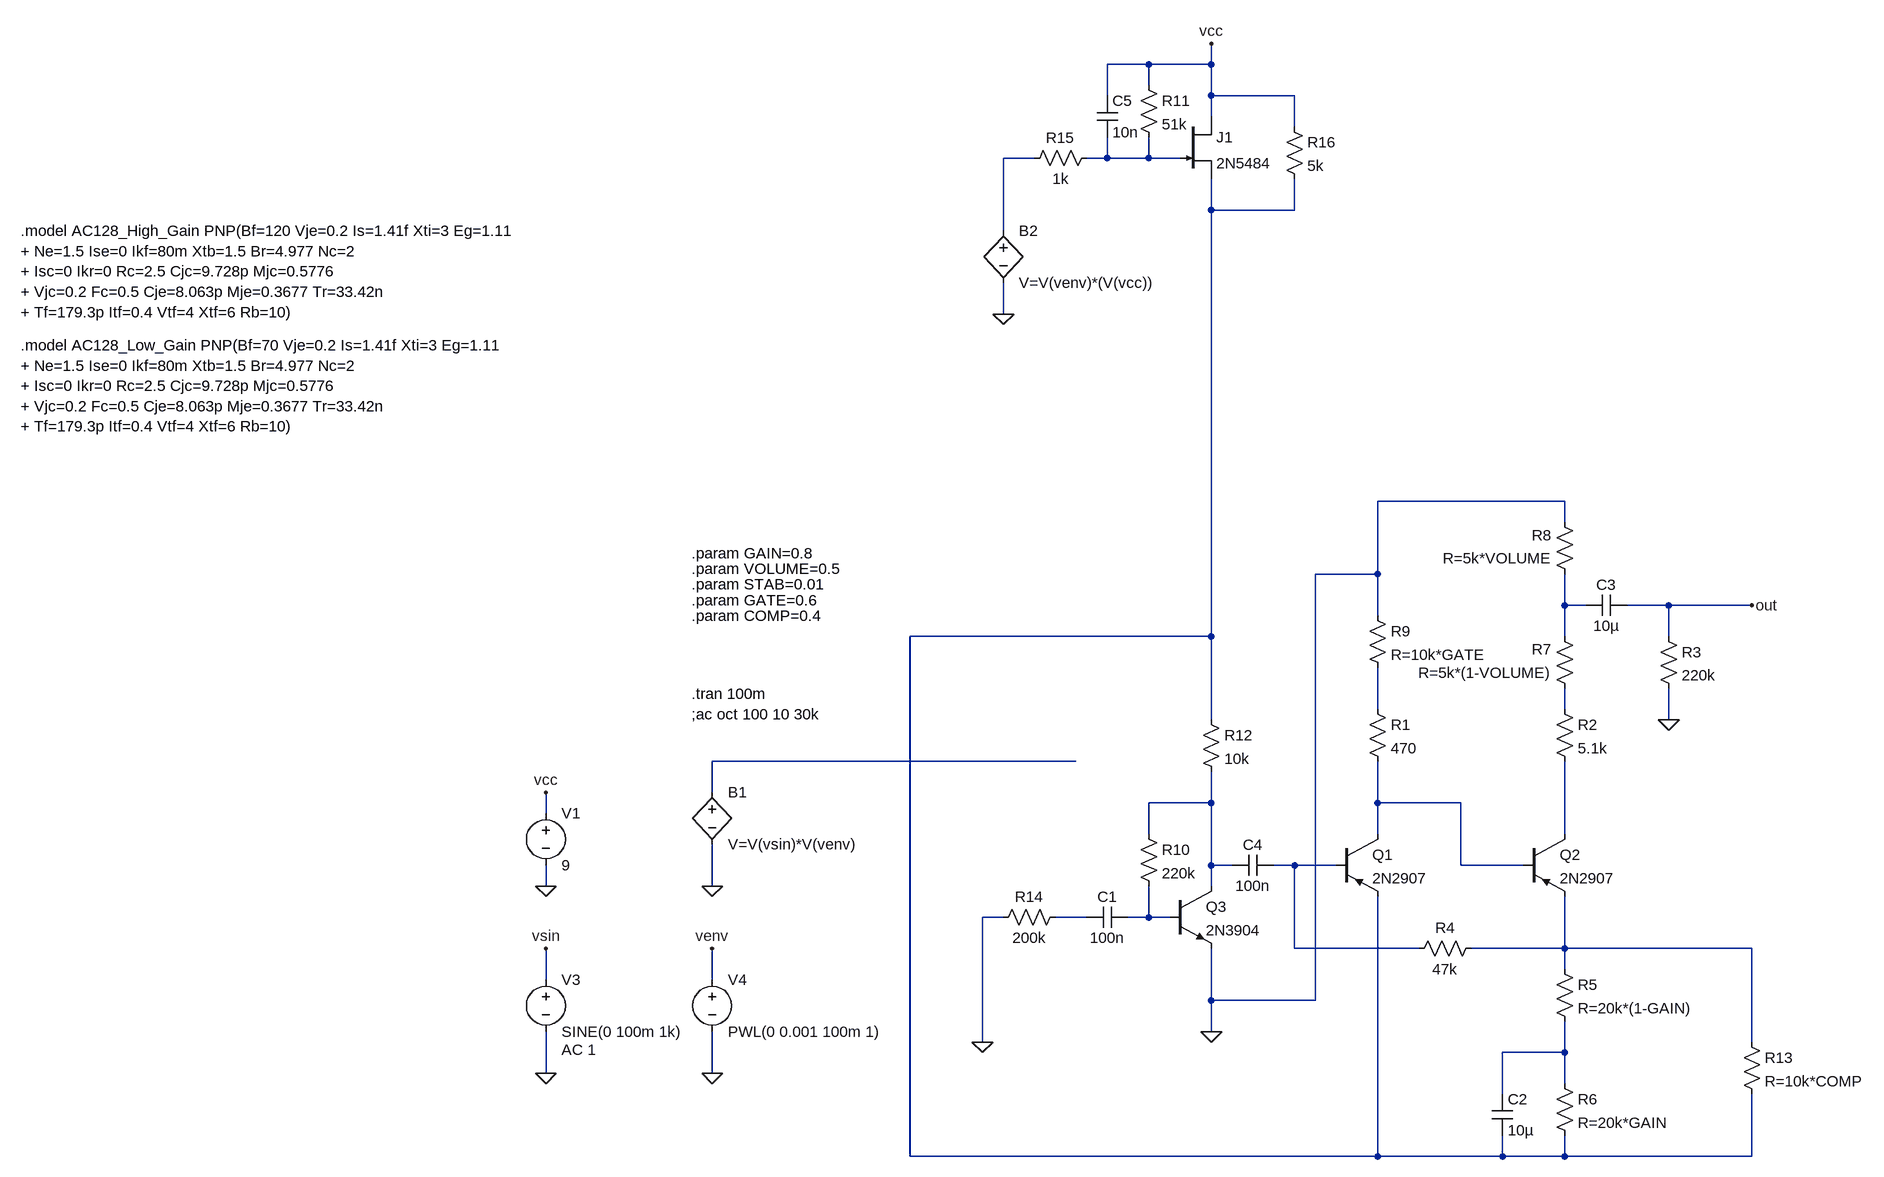
[diagram p0: schematic fuzz_factory_05.asc]
fuzz_factory_05.asc, the LTspice schematic file:
Version 4
SHEET 1 1968 1668
WIRE -64 -1040 -128 -1040
WIRE 32 -1040 32 -1072
WIRE 32 -1040 -64 -1040
WIRE -64 -1008 -64 -1040
WIRE -128 -992 -128 -1040
WIRE 32 -992 32 -1040
WIRE 160 -992 32 -992
WIRE 32 -960 32 -992
WIRE 160 -944 160 -992
WIRE -240 -896 -288 -896
WIRE -128 -896 -128 -928
WIRE -128 -896 -160 -896
WIRE -64 -896 -64 -928
WIRE -64 -896 -128 -896
WIRE -16 -896 -64 -896
WIRE 32 -816 32 -864
WIRE 160 -816 160 -864
WIRE 160 -816 32 -816
WIRE -288 -784 -288 -896
WIRE -288 -656 -288 -704
WIRE 576 -368 288 -368
WIRE 576 -336 576 -368
WIRE 288 -256 288 -368
WIRE 288 -256 192 -256
WIRE 576 -208 576 -256
WIRE 608 -208 576 -208
WIRE 736 -208 672 -208
WIRE 864 -208 736 -208
WIRE 288 -192 288 -256
WIRE 32 -160 32 -816
WIRE 32 -160 -432 -160
WIRE 576 -160 576 -208
WIRE 736 -160 736 -208
WIRE 288 -48 288 -112
WIRE 576 -48 576 -80
WIRE 32 -32 32 -160
WIRE 736 -32 736 -80
WIRE -176 32 -736 32
WIRE -736 80 -736 32
WIRE 32 96 32 48
WIRE 32 96 -64 96
WIRE 288 96 288 32
WIRE 416 96 288 96
WIRE -992 112 -992 80
WIRE -64 144 -64 96
WIRE 288 144 288 96
WIRE 576 144 576 32
WIRE 32 192 32 96
WIRE 64 192 32 192
WIRE 160 192 128 192
WIRE 224 192 160 192
WIRE 416 192 416 96
WIRE 512 192 416 192
WIRE -992 224 -992 192
WIRE -736 224 -736 160
WIRE 32 224 32 192
WIRE -288 272 -320 272
WIRE -160 272 -208 272
WIRE -64 272 -64 224
WIRE -64 272 -96 272
WIRE -32 272 -64 272
WIRE 160 320 160 192
WIRE 352 320 160 320
WIRE 576 320 576 240
WIRE 576 320 432 320
WIRE 864 320 576 320
WIRE 576 352 576 320
WIRE -992 368 -992 320
WIRE -736 368 -736 320
WIRE 32 400 32 320
WIRE 192 400 192 -256
WIRE 192 400 32 400
WIRE 32 448 32 400
WIRE -320 464 -320 272
WIRE 864 464 864 320
WIRE 576 480 576 432
WIRE 576 480 480 480
WIRE -992 512 -992 448
WIRE -736 512 -736 448
WIRE 576 528 576 480
WIRE 480 544 480 480
WIRE -432 640 -432 -160
WIRE 288 640 288 240
WIRE 288 640 -432 640
WIRE 480 640 480 608
WIRE 480 640 288 640
WIRE 576 640 576 608
WIRE 576 640 480 640
WIRE 864 640 864 544
WIRE 864 640 576 640
FLAG -992 80 vcc
FLAG -992 224 0
FLAG 864 -208 out
FLAG -736 224 0
FLAG -992 512 0
FLAG -736 512 0
FLAG -992 320 vsin
FLAG -736 320 venv
FLAG 736 -32 0
FLAG -320 464 0
FLAG 32 448 0
FLAG -288 -656 0
FLAG 32 -1072 vcc
SYMBOL voltage -992 96 R0
WINDOW 123 0 0 Left 2
WINDOW 39 0 0 Left 2
SYMATTR InstName V1
SYMATTR Value 9
SYMBOL voltage -992 352 R0
WINDOW 123 24 124 Left 2
WINDOW 39 0 0 Left 2
SYMATTR Value2 AC 1
SYMATTR InstName V3
SYMATTR Value SINE(0 100m 1k)
SYMBOL voltage -736 352 R0
WINDOW 123 0 0 Left 2
WINDOW 39 0 0 Left 2
SYMATTR InstName V4
SYMATTR Value PWL(0 0.001 100m 1)
SYMBOL bv -736 64 R0
SYMATTR InstName B1
SYMATTR Value V=V(vsin)*V(venv)
SYMBOL pnp 224 144 R0
SYMATTR InstName Q1
SYMATTR Value 2N2907
SYMBOL pnp 512 144 R0
SYMATTR InstName Q2
SYMATTR Value 2N2907
SYMBOL cap -96 256 R90
WINDOW 0 0 32 VBottom 2
WINDOW 3 32 32 VTop 2
SYMATTR InstName C1
SYMATTR Value 100n
SYMBOL res 272 -64 R0
SYMATTR InstName R1
SYMATTR Value 470
SYMBOL res 560 -64 R0
SYMATTR InstName R2
SYMATTR Value 5.1k
SYMBOL res 448 304 R90
WINDOW 0 0 56 VBottom 2
WINDOW 3 32 56 VTop 2
SYMATTR InstName R4
SYMATTR Value 47k
SYMBOL res 560 336 R0
SYMATTR InstName R5
SYMATTR Value R=20k*(1-GAIN)
SYMBOL res 560 512 R0
SYMATTR InstName R6
SYMATTR Value R=20k*GAIN
SYMBOL cap 464 544 R0
SYMATTR InstName C2
SYMATTR Value 10µ
SYMBOL res 592 -64 R180
WINDOW 0 36 76 Left 2
WINDOW 3 36 40 Left 2
SYMATTR InstName R7
SYMATTR Value R=5k*(1-VOLUME)
SYMBOL res 592 -240 R180
WINDOW 0 36 76 Left 2
WINDOW 3 36 40 Left 2
SYMATTR InstName R8
SYMATTR Value R=5k*VOLUME
SYMBOL npn -32 224 R0
SYMATTR InstName Q3
SYMATTR Value 2N3904
SYMBOL res -80 128 R0
SYMATTR InstName R10
SYMATTR Value 220k
SYMBOL cap 128 176 R90
WINDOW 0 0 32 VBottom 2
WINDOW 3 32 32 VTop 2
SYMATTR InstName C4
SYMATTR Value 100n
SYMBOL cap 672 -224 R90
WINDOW 0 0 32 VBottom 2
WINDOW 3 32 32 VTop 2
SYMATTR InstName C3
SYMATTR Value 10µ
SYMBOL res 720 -176 R0
SYMATTR InstName R3
SYMATTR Value 220k
SYMBOL res 272 -208 R0
SYMATTR InstName R9
SYMATTR Value R=10k*GATE
SYMBOL res 16 -48 R0
SYMATTR InstName R12
SYMATTR Value 10k
SYMBOL res 848 448 R0
SYMATTR InstName R13
SYMATTR Value R=10k*COMP
SYMBOL res -192 256 R90
WINDOW 0 0 56 VBottom 2
WINDOW 3 32 56 VTop 2
SYMATTR InstName R14
SYMATTR Value 200k
SYMBOL bv -288 -800 R0
SYMATTR InstName B2
SYMATTR Value V=V(venv)*(V(vcc))
SYMBOL njf -16 -960 R0
SYMATTR InstName J1
SYMATTR Value 2N5484
SYMBOL res -80 -1024 R0
SYMATTR InstName R11
SYMATTR Value 51k
SYMBOL cap -144 -992 R0
SYMATTR InstName C5
SYMATTR Value 10n
SYMBOL res -144 -912 R90
WINDOW 0 0 56 VBottom 2
WINDOW 3 32 56 VTop 2
SYMATTR InstName R15
SYMATTR Value 1k
SYMBOL res 144 -960 R0
SYMATTR InstName R16
SYMATTR Value 5k
TEXT -768 -288 Left 2 !.param GAIN=0.8
TEXT -768 -264 Left 2 !.param VOLUME=0.5
TEXT -768 -240 Left 2 !.param STAB=0.01
TEXT -768 -72 Left 2 !.tran 100m
TEXT -768 -40 Left 2 !;ac oct 100 10 30k
TEXT -1800 -608 Left 2 !.model AC128_Low_Gain PNP(Bf=70 Vje=0.2 Is=1.41f Xti=3 Eg=1.11\n+ Ne=1.5 Ise=0 Ikf=80m Xtb=1.5 Br=4.977 Nc=2\n+ Isc=0 Ikr=0 Rc=2.5 Cjc=9.728p Mjc=0.5776\n+ Vjc=0.2 Fc=0.5 Cje=8.063p Mje=0.3677 Tr=33.42n\n+ Tf=179.3p Itf=0.4 Vtf=4 Xtf=6 Rb=10)
TEXT -1800 -784 Left 2 !.model AC128_High_Gain PNP(Bf=120 Vje=0.2 Is=1.41f Xti=3 Eg=1.11\n+ Ne=1.5 Ise=0 Ikf=80m Xtb=1.5 Br=4.977 Nc=2\n+ Isc=0 Ikr=0 Rc=2.5 Cjc=9.728p Mjc=0.5776\n+ Vjc=0.2 Fc=0.5 Cje=8.063p Mje=0.3677 Tr=33.42n\n+ Tf=179.3p Itf=0.4 Vtf=4 Xtf=6 Rb=10)
TEXT -768 -216 Left 2 !.param GATE=0.6
TEXT -768 -192 Left 2 !.param COMP=0.4

The netlist it stands for:
* fuzz_factory_05.asc
V1 vcc 0 9
V3 vsin 0 SINE(0 100m 1k) AC 1
V4 venv 0 PWL(0 0.001 100m 1)
B1 N007 0 V=V(vsin)*V(venv)
Q1 N009 N011 N003 0 2N2907
Q2 N010 N009 N014 0 2N2907
C1 N013 N012 100n
R1 N005 N009 470
R2 N006 N010 5.1k
R4 N014 N011 47k
R5 N014 N015 R=20k*(1-GAIN)
R6 N015 N003 R=20k*GAIN
C2 N015 N003 10µ
R7 N006 N004 R=5k*(1-VOLUME)
R8 N004 0 R=5k*VOLUME
Q3 N008 N013 0 0 2N3904
R10 N008 N013 220k
C4 N011 N008 100n
C3 out N004 10µ
R3 out 0 220k
R9 0 N005 R=10k*GATE
R12 N003 N008 10k
R13 N014 N003 R=10k*COMP
R14 N012 0 200k
B2 N001 0 V=V(venv)*(V(vcc))
J1 vcc N002 N003 2N5484
R11 vcc N002 51k
C5 vcc N002 10n
R15 N002 N001 1k
R16 vcc N003 5k
.model NPN NPN
.model PNP PNP
.lib standard.bjt
.model NJF NJF
.model PJF PJF
.lib standard.jft
.param GAIN=0.8
.param VOLUME=0.5
.param STAB=0.01
.tran 100m
;ac oct 100 10 30k
.model AC128_Low_Gain PNP(Bf=70 Vje=0.2 Is=1.41f Xti=3 Eg=1.11
+ Ne=1.5 Ise=0 Ikf=80m Xtb=1.5 Br=4.977 Nc=2
+ Isc=0 Ikr=0 Rc=2.5 Cjc=9.728p Mjc=0.5776
+ Vjc=0.2 Fc=0.5 Cje=8.063p Mje=0.3677 Tr=33.42n
+ Tf=179.3p Itf=0.4 Vtf=4 Xtf=6 Rb=10)
.model AC128_High_Gain PNP(Bf=120 Vje=0.2 Is=1.41f Xti=3 Eg=1.11
+ Ne=1.5 Ise=0 Ikf=80m Xtb=1.5 Br=4.977 Nc=2
+ Isc=0 Ikr=0 Rc=2.5 Cjc=9.728p Mjc=0.5776
+ Vjc=0.2 Fc=0.5 Cje=8.063p Mje=0.3677 Tr=33.42n
+ Tf=179.3p Itf=0.4 Vtf=4 Xtf=6 Rb=10)
.param GATE=0.6
.param COMP=0.4
.backanno
.end